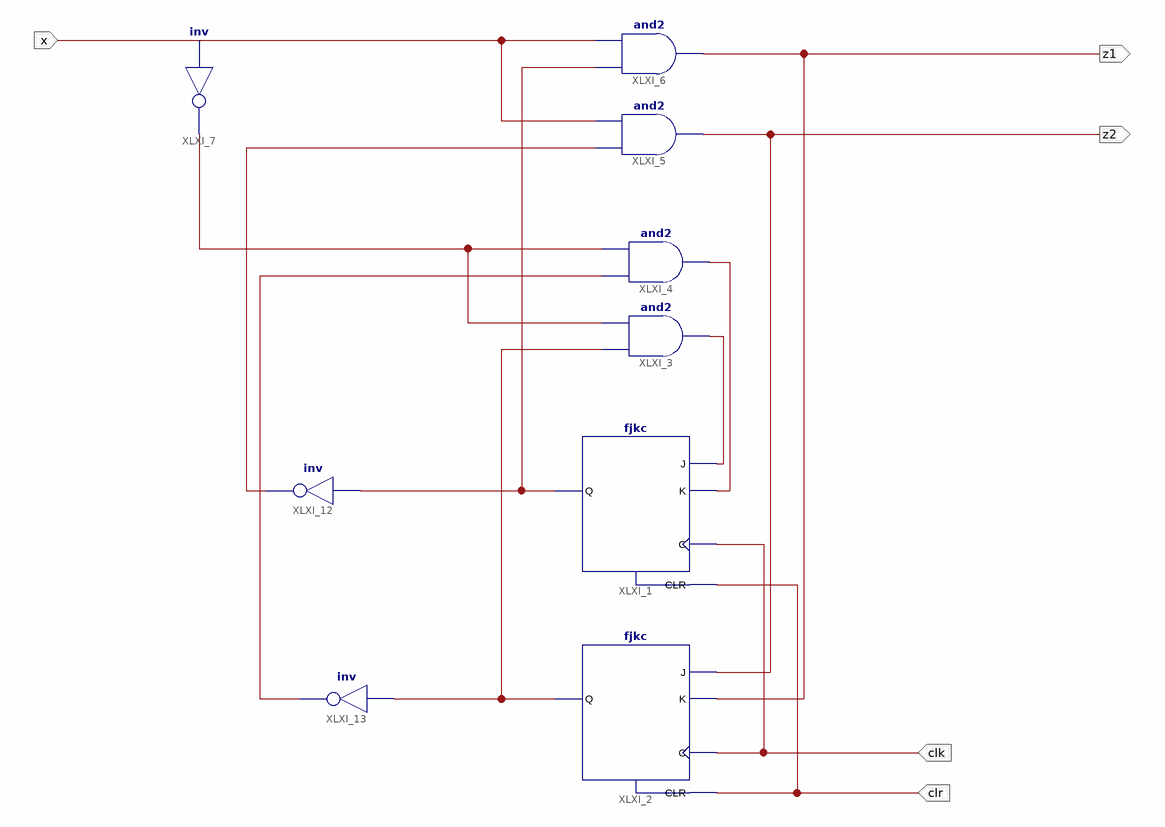
[diagram p0: schematic sheet 1]
// Xilinx ISE schematic Controller.sch (spartan6) as structural Verilog: 9 symbols, 5 ports
module Controller (
  input  x,
  input  clk,
  input  clr,
  output z1,
  output z2
);

  wire XLXN_18, XLXN_19, XLXN_21, XLXN_22, XLXN_23, XLXN_25, XLXN_26;

  and XLXI_5 (z2, XLXN_19, x);
  and XLXI_6 (z1, XLXN_18, x);
  not XLXI_7 (XLXN_23, x);
  fjkc XLXI_2 (.C(clk), .CLR(clr), .J(z2), .K(z1), .Q(XLXN_21));
  fjkc XLXI_1 (.C(clk), .CLR(clr), .J(XLXN_25), .K(XLXN_26), .Q(XLXN_18));
  and XLXI_3 (XLXN_25, XLXN_21, XLXN_23);
  and XLXI_4 (XLXN_26, XLXN_22, XLXN_23);
  not XLXI_12 (XLXN_19, XLXN_18);
  not XLXI_13 (XLXN_22, XLXN_21);
endmodule
